# EAGLE design Mix necessary function (EAGLE 9.6.2)
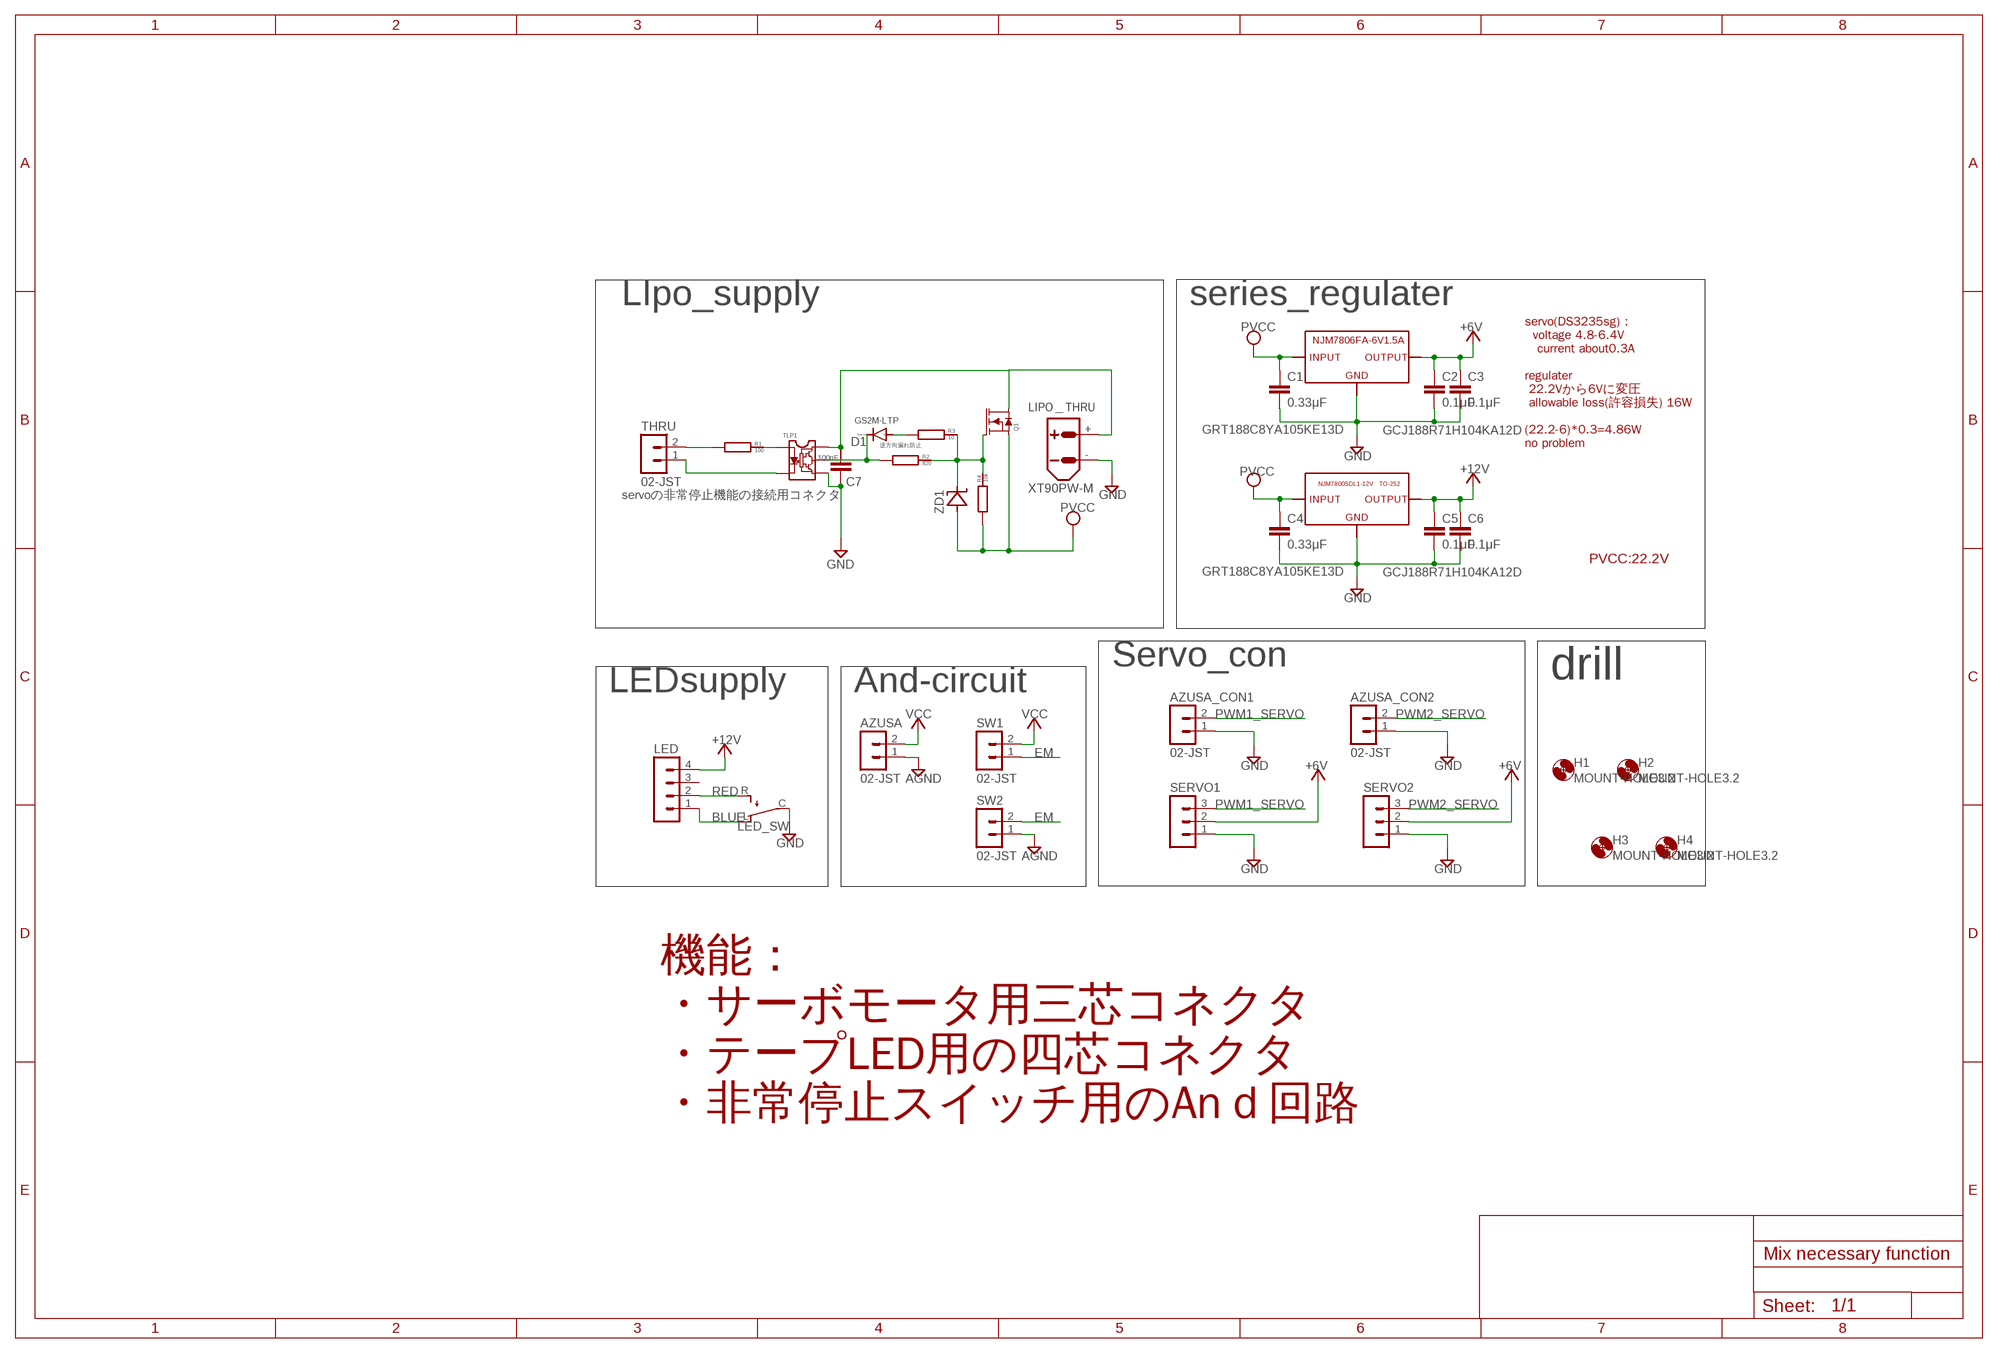
[diagram p0: schematic, sheet 1]

## Parts
AZUSA  02-JST  [B2B-XH]
AZUSA_CON1  02-JST  [B2B-XH]
AZUSA_CON2  02-JST  [B2B-XH]
C1  0.33μF  GRM0335C1E240GA01D  [GRM0335C1E240GA01D]
C2  0.1μF  GRM0335C1E240GA01D  [GRM0335C1E240GA01D]
C3  0.1μF  GRM0335C1E240GA01D  [GRM0335C1E240GA01D]
C4  0.33μF  GRM0335C1E240GA01D  [GRM0335C1E240GA01D]
C5  0.1μF  GRM0335C1E240GA01D  [GRM0335C1E240GA01D]
C6  0.1μF  GRM0335C1E240GA01D  [GRM0335C1E240GA01D]
C7  GCM188L81H104KA57  [GCM188L81H104KA57]
D1  GS2M-LTP  [GS2M-LTP]
H1  MOUNT-HOLE3.2  [3,2]
H2  MOUNT-HOLE3.2  [3,2]
H3  MOUNT-HOLE3.2  [3,2]
H4  MOUNT-HOLE3.2  [3,2]
LED  04-JST  [B4B-XH]
LED_SW  SS-12SDP2  [SS-12SDP2]
LIPO＿THRU  XT90PW-M  [XT90PW-M]
Q1  SQJA16EP-T1_GE3  [SQJA16EP-T1_GE3]
R1  100  CR0603  [CR0603]
R2  820  CR0603  [CR0603]
R3  10  CR0603  [CR0603]
R4  10k  CR0603  [CR0603]
SERVO1  03-JST  [B3B-XH]
SERVO2  03-JST  [B3B-XH]
SW1  02-JST  [B2B-XH]
SW2  02-JST  [B2B-XH]
THRU  02-JST  [B2B-XH]
TLP1  TLP152  [TLP152]
U$1  ＮＪＭ７８０６ＦＡ-6V  [ＮＪＭ７８０６ＦＡ-6V]
U$17  NJM7800SDL1-12V  [NJM7800SDL1-12V]
ZD1  MMBZ5248B-TP  [MMBZ5248B-TP]

## Nets
+6V: C2.1 C3.1 SERVO1.2 SERVO2.2 U$1.OUTPUT ; supply symbol labelled VCC
+12V: C5.1 C6.1 LED.4 U$17.VOUT(OUTPUT) ; supply symbol labelled VCC
AGND: AZUSA.1 SW2.1 ; supply symbol labelled GND
BLUE: LED.1 LED_SW.L
EM: SW1.1 SW2.2
GND: AZUSA_CON1.1 AZUSA_CON2.1 C1.2 C2.2 C3.2 C4.2 C5.2 C6.2 C7.P$2 LED_SW.C LIPO＿THRU.- SERVO1.1 SERVO2.1 TLP1.GND U$1.GND U$17.GND
N$1: THRU.1 TLP1.CATHODE
N$6: D1.C R2.LEFT TLP1.VO(VOUT)
N$7: Q1.G R2.RIGHT R3.RIGHT R4.RIGHT ZD1.CATHODE(C)
N$8: D1.A R3.LEFT
N$20: C7.P$1 LIPO＿THRU.+ Q1.D TLP1.VCC
N$92: R1.LEFT THRU.2
N$118: R1.RIGHT TLP1.ANODE
PVCC: C1.1 C4.1 Q1.S1(S) Q1.S2(S) Q1.S3(S) R4.LEFT U$1.INPUT U$17.VIN(INPUT) ZD1.ANODE(A) ; supply symbol labelled VCC
PWM1_SERVO: AZUSA_CON1.2 SERVO1.3
PWM2_SERVO: AZUSA_CON2.2 SERVO2.3
RED: LED.2 LED_SW.R
VCC: AZUSA.2 SW1.2
Unconnected: LED.3

## Notes on the sheet
- LIpo_supply | series_regulater
- GCJ188R71H104KA12D
- 逆方向漏れ防止 | GRT188C8YA105KE13D
- servo(DS3235sg)：
    voltage 4.8-6.4V
  　current about0.3A
  
  regulater
   22.2Vから6Vに変圧
   allowable loss(許容損失) 16W
  
  (22.2-6)*0.3=4.86W
  no problem
- servoの非常停止機能の接続用コネクタ
- PVCC:22.2V
- GCJ188R71H104KA12D
- GRT188C8YA105KE13D
- Servo_con
- drill
- LEDsupply | And-circuit
- 機能：
  ・サーボモータ用三芯コネクタ
  ・テープLED用の四芯コネクタ
  ・非常停止スイッチ用のAnｄ回路

## Library data of the parts
AZUSA AZUSA_CON1 AZUSA_CON2 SW1 SW2 THRU = con-jst-xh (1):02-JST: JST CONNECTOR
C1-C6 = GRM0335C1E240GA01D:GRM0335C1E240GA01D
C7 = GCM188L81H104K57(0.1uF):GCM188L81H104KA57
D1 = GS2M-LTP:GS2M-LTP
H1-H4 = holes:MOUNT-HOLE: MOUNTING HOLE with drill center marker
LED = con-jst-xh (1):04-JST: JST CONNECTOR
LED_SW = SS-12SDP2:SS-12SDP2
LIPO＿THRU = amass:XT90: AMASS XT90 connector Store in Japan AMASS XT90 connector <https://szc.jp/ams-xt90>
Q1 = SQJA16EP-T1_GE3:SQJA16EP-T1_GE3
R1-R4 = CR0603:CR0603
SERVO1 SERVO2 = con-jst-xh (1):03-JST: JST CONNECTOR
TLP1 = TLP152:TLP152
U$1 = NJM7806FA-6V:ＮＪＭ７８０６ＦＡ-6V
U$17 = TO-250 NJM7800SDL1-12V:NJM7800SDL1-12V
ZD1 = MMBZ5248B-TP:MMBZ5248B-TP

## Board
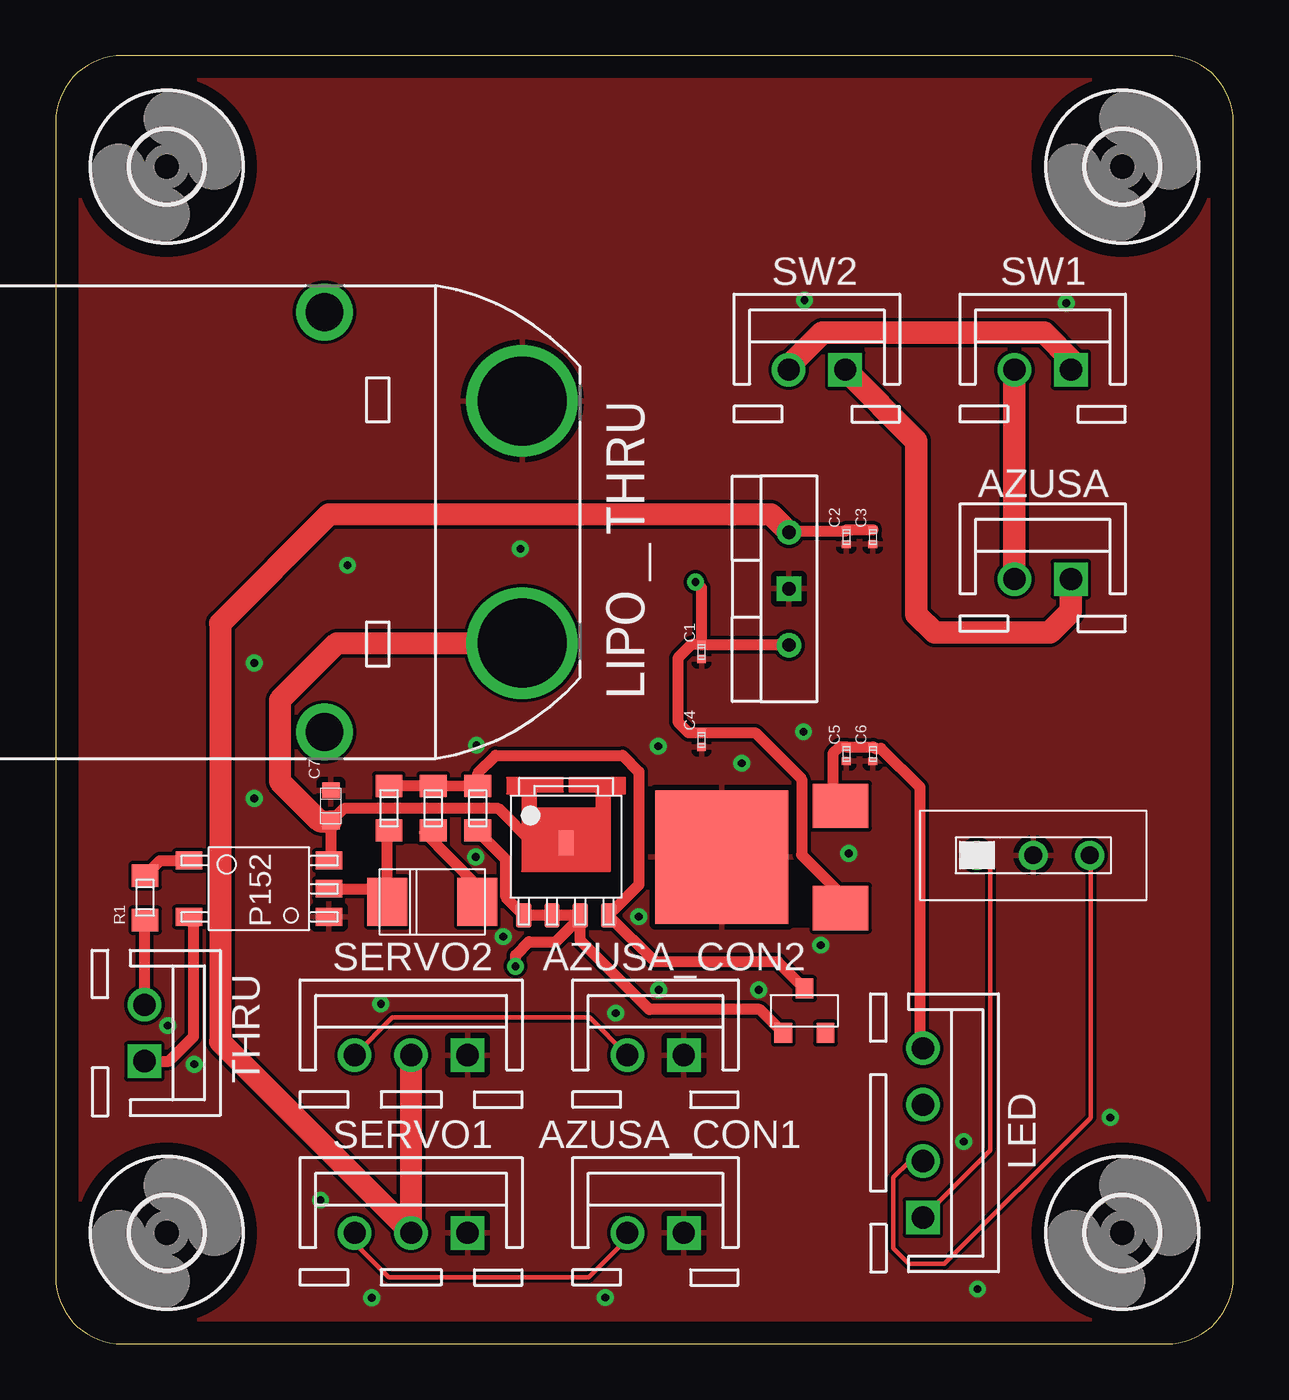
[diagram p1: board, top side]
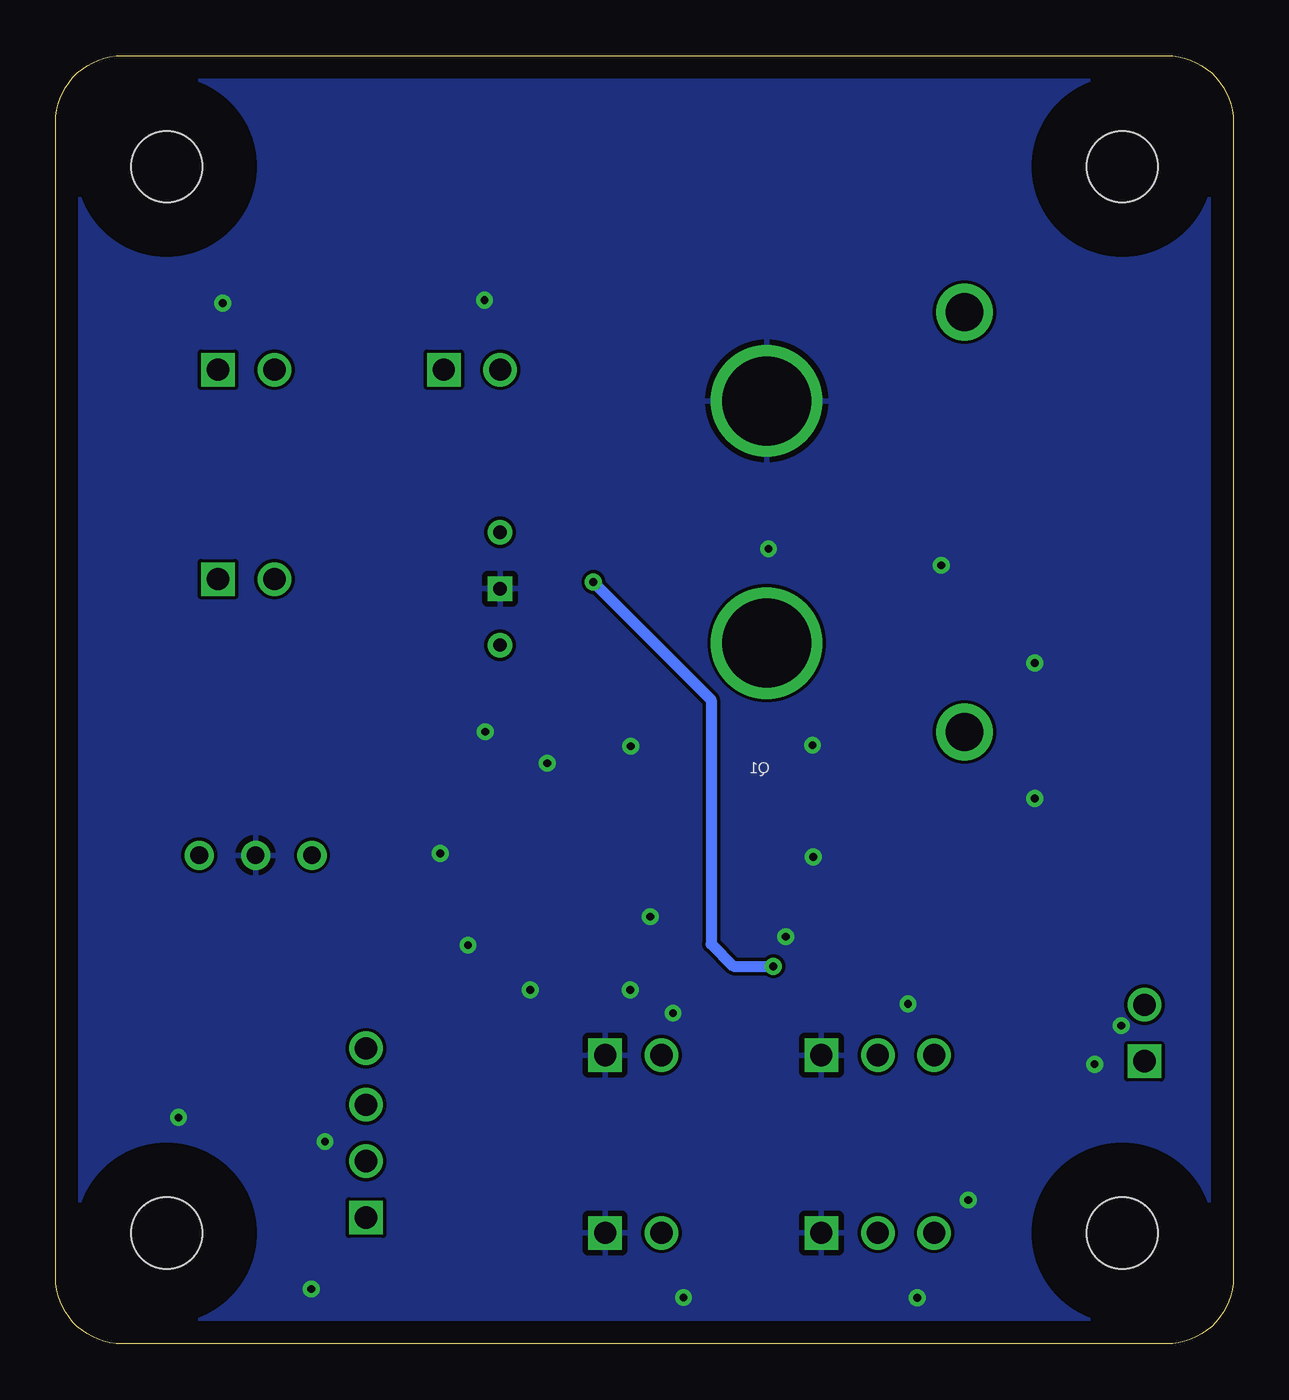
[diagram p2: board, bottom side, seen from below]

Size 53 x 58 mm. Coordinates in mm from the lower left corner, seen from the top.
Outline: 0,55 0,3 arc90 3,0 50,0 arc90 53,3 53,55 arc90 50,58 3,58 arc90 0,55
Copper layers (1*16): Top 0.035mm / dielectric 1.5mm / Bottom 0.035mm
Design rules "default": minimum track width 6mil, minimum drill 0.35mm, track to track 6mil, track to pad 6mil, pad to pad 6mil, via to via 6mil, smd to smd 6mil, copper to edge 40mil, drill to drill 6mil, minimum pad ring 10mil, minimum via ring 8mil, stop-mask expansion 4mil, vias tented up to drill 0mil, thermal gap 10mil

### Footprints (pad centres in the part's own frame; a part is rotated, then mirrored left to right if it is on the bottom)
B2B-XH = drill 1 square: 1 1.27,0 | drill 1: 2 -1.27,0
GRM0335C1E240GA01D = smd 0.35 x 0.4: 1 -0.325,0; 2 0.325,0
GCM188L81H104KA57 = smd 0.7 x 0.8: P$1 -0.7,0; P$2 0.7,0
GS2M-LTP = smd 1.78 x 2.16: A -2.025,0; C 2.025,0
3,2 = hole 3.2: 0,0
B4B-XH = drill 1 square: 1 3.81,0 | drill 1: 2 1.27,0; 3 -1.27,0; 4 -3.81,0
SS-12SDP2 = drill 0.8 pad 1.3: C 0,0; L -2.54,0; R 2.54,0
XT90PW-M = drill 4: + -5.45,0; - 5.45,0 | drill 1.7: P$3 -9.45,8.9; P$4 9.45,8.9
SQJA16EP-T1_GE3 = smd 0.68 x 1.1: D 0,1.27; G 1.905,-1.99; S1 -1.905,-1.99; S2 -0.635,-1.99; S3 0.635,-1.99
CR0603 = smd 1 x 1.2: LEFT -1,0; RIGHT 1,0
B3B-XH = drill 1 square: 1 2.54,0 | drill 1: 2 0,0; 3 -2.54,0
TLP152 = smd 0.8 x 1.2: ANODE -1.27,0; CATHODE 1.27,0; GND 1.27,6.3; VCC -1.27,6.3; VO 0,6.3
ＮＪＭ７８０６ＦＡ-6V = drill 0.6 square: GND 0,0 | drill 0.6: INPUT -2.54,0; OUTPUT 2.54,0
NJM7800SDL1-12V = smd 6 x 6: GND 0,3 | smd 2 x 2.5: VIN -2.3,-2.35; VOUT 2.3,-2.35
MMBZ5248B-TP = smd 0.8 x 0.9: ANODE -0.95,-1; CATHODE 0,1; NC 0.95,-1

### Placement (x,y rotation side)
AZUSA  44.42,34.43 0 top
AZUSA_CON1  27,5 0 top
AZUSA_CON2  27,13 0 top
C1  29.07,31.16 270 top
C2  35.59,36.33 270 top
C3  36.78,36.33 270 top
C4  29.07,27.2 270 top
C5  35.59,26.56 270 top
C6  36.78,26.56 270 top
C7  12.39,24.22 90 top
D1  16.95,19.91 180 top
H1  5,53 0 top
H2  48,53 0 top
H3  5,5 0 top
H4  48,5 0 top
LED  39.03,9.5 270 top
LED_SW  44,22 0 top
LIPO＿THRU  21,37 90 top
Q1  22.98,21.29 0 top
R1  4.03,20.08 90 top
R2  15,24.12 90 top
R3  17,24.12 90 top
R4  19,24.12 90 top
SERVO1  16,5 0 top
SERVO2  16,13 0 top
SW1  44.42,43.86 0 top
SW2  34.26,43.86 0 top
THRU  4,14 270 top
TLP1  6,20.49 270 top
U$1  33,34 90 top
U$17  32.98,21.92 90 top
ZD1  33.7,15 0 top

### Tracks (layer width: path | path; a pad name or v marks a point on that pad's centre or on a via)
+6V
  Top 0.5: U$1.OUTPUT 33.04,36.58 35.51,36.58 C2.1 C3.1
  Top 1: U$1.OUTPUT 32.2,37.34 12.3,37.34 7.4,32.44 7.4,13.6 SERVO1.2 SERVO2.2
+12V
  Top 0.5: LED.4 38.89,13.45 38.89,25.07 37.15,26.81 36.85,26.81 C6.1 C5.1 35.29,26.88 34.98,26.58 34.98,24.56 U$17.VOUT
AGND
  Top 1.016: SW2.1 38.74,40.65 38.74,32.84 39.56,32.02 44.74,32.02 45.69,32.97 AZUSA.1
BLUE
  Top 0.2: LED_SW.L 42.06,21.4 42.06,8.72 LED.1
EM
  Top 1.016: SW2.2 32.99,44.02 34.5,45.53 44.48,45.53 45.69,44.32 SW1.1
GND  (via drill 0.35)
  other vias: 14.64,15.3 11.92,6.48 25.21,14.89 14.23,2.08 24.74,2.09 41.49,2.47 47.47,10.2 40.87,9.11 30.88,26.14 27.12,26.91 6.24,12.59 5.05,14.33 20.14,18.34 18.91,21.92 18.94,26.95 20.92,35.79 33.7,46.98 45.48,46.86 35.69,22.08 33.66,27.56 26.24,19.24 8.94,30.65 13.14,35.05 8.94,24.55 34.44,17.95 27.14,15.94 31.64,15.94
  pour Top: -1,60 -7,54 -7,4 -2,-1 53,-1 57,3 57,56 53,60
  pour Bottom: -1,59 -6,54 -6,2 -2,-2 53,-2 56,1 56,57 54,59
  cutout Top: 33,19 34,19 34,20 33,20
  cutout Top: 15.7,22.6 16.3,22.6 16.3,23.1 15.6,23.1 15.6,22.6
  cutout Top: 24.1,18.7 24.6,18.7 24.6,19 24.4,19.2 24.1,19.2
N$1
  Top 0.5: TLP1.CATHODE 6.2,19.02 6.2,13.83 5.1,12.73 THRU.1
N$6
  Top 0.5: TLP1.VO 14.34,20.49 D1.C 14.93,22.89 R2.LEFT
N$7
  Top 0.5: R2.RIGHT R3.RIGHT 18.53,25.1 R4.RIGHT 19,25.7 19.8,26.5 25.51,26.5 26.25,25.76 26.25,20.67 Q1.G 26.98,17.2 32.5,17.2 ZD1.CATHODE
N$8
  Top 0.5: R3.LEFT 16.61,23.02 18.98,20.63 D1.A
N$20
  Top 0.5: 12.39,21.67 TLP1.VCC | 12.39,21.67 C7.P$1 12.97,24.1 19.94,24.1 21.48,22.56 Q1.D | 12.39,21.67 12.4,21.66
  Top 1: C7.P$1 11.89,23.52 10.09,25.32 10.09,28.99 12.66,31.55 LIPO＿THRU.+
N$92
  Top 0.5: R1.LEFT 4,18.89 THRU.2
N$118
  Top 0.5: R1.RIGHT 4.71,21.76 TLP1.ANODE
PVCC  (via drill 0.35)
  Top 0.2: 32.98,31.48 U$1.INPUT
  Top 0.5: C1.1 32.98,31.48 | C1.1 28.61,31.48 28,30.88 28,28 28.48,27.52 C4.1 31.48,27.52 33.57,25.43 33.57,22.02 35.33,20.26 U$17.VIN | Q1.S3 Q1.S2 Q1.S1 20.27,20.1 20.27,21.81 19,23.08 R4.LEFT | Q1.S3 23.61,19.2 22.51,18.1 21.3,18.1 20.7,17.5 v20.7,17 | ZD1.ANODE 31.69,15.06 26.72,15.06 23.61,18.17 Q1.S3 | C1.1 29.07,34.03 v28.8,34.3
  Bottom 0.5: v28.8,34.3 23.5,29 23.5,18 22.5,17 v20.7,17
PWM1_SERVO
  Top 0.2: SERVO1.3 13.46,4.54 15,3 24,3 25.73,4.73 AZUSA_CON1.2
PWM2_SERVO
  Top 0.2: SERVO2.3 15.16,14.7 24.03,14.7 AZUSA_CON2.2
RED
  Top 0.2: LED_SW.R 46.59,21.95 46.59,10.19 40,3.6 38.4,3.6 37.7,4.3 37.7,7.49 38.44,8.23 LED.2
VCC
  Top 1.016: AZUSA.2 SW1.2

### Text on the board
tPlace: R1